# EAGLE design hackspace_sense (EAGLE 9.6.2)
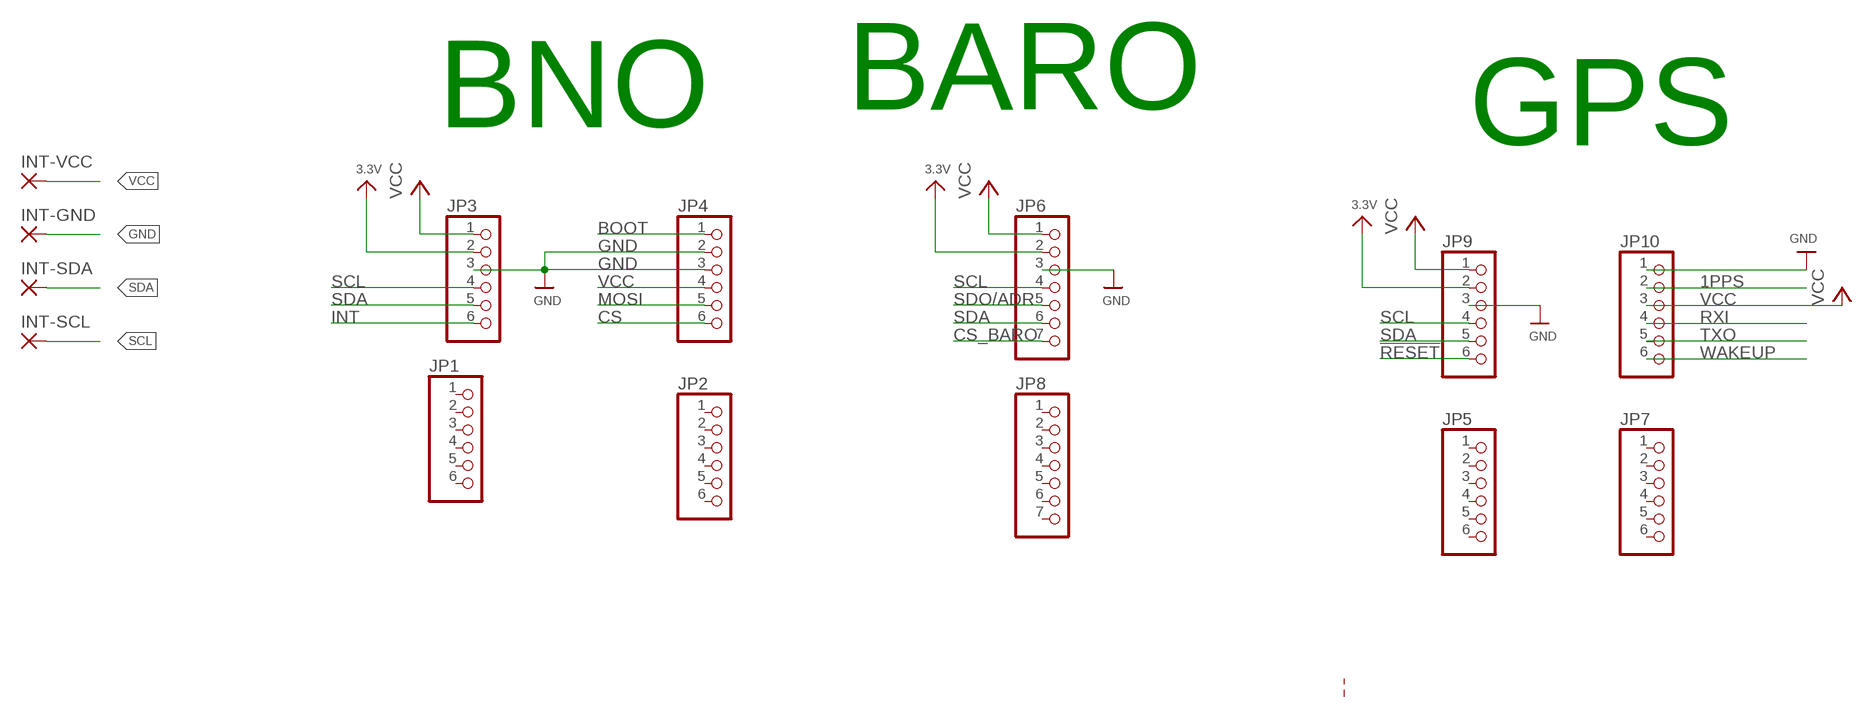
[diagram p0: schematic, sheet 1]

## Parts
INT-GND  3,17/1,1  [3,17/1,1]
INT-SCL  3,17/1,1  [3,17/1,1]
INT-SDA  3,17/1,1  [3,17/1,1]
INT-VCC  3,17/1,1  [3,17/1,1]
JP1  PINHD-1X6  [1X06]
JP2  PINHD-1X6  [1X06]
JP3  HEADER-1X670MIL  [1X06_ROUND_70]
JP4  HEADER-1X670MIL  [1X06_ROUND_70]
JP5  PINHD-1X6  [1X06]
JP6  HEADER-1X770MIL  [1X07_ROUND_70]
JP7  PINHD-1X6  [1X06]
JP8  PINHD-1X7  [1X07]
JP9  HEADER-1X670MIL  [1X06_ROUND_70]
JP10  HEADER-1X670MIL  [1X06_ROUND_70]

## Nets
1PPS: JP10.2
3.3V_BARO [lowpower]: JP6.2 ; supply symbol labelled 3.3V
3.3V_BNO [lowpower]: JP3.2 ; supply symbol labelled 3.3V
3.3V_GPS [lowpower]: JP9.2 ; supply symbol labelled 3.3V
!RESET: JP9.6
BOOT: JP4.1
CS: JP4.6
CS_BARO: JP6.7
GND: INT-GND.1(P) JP3.3 JP4.2 JP4.3 JP6.3 JP9.3 JP10.1
INT: JP3.6
MOSI: JP4.5
RXI: JP10.4
SCL: INT-SCL.1(P) JP3.4 JP6.4 JP9.4
SDA: INT-SDA.1(P) JP3.5 JP6.6 JP9.5
SDO/ADR: JP6.5
TXO: JP10.5
VCC: INT-VCC.1(P) JP3.1 JP4.4 JP6.1 JP9.1 JP10.3
WAKEUP: JP10.6
Unconnected: JP1.1 JP1.2 JP1.3 JP1.4 JP1.5 JP1.6 JP2.1 JP2.2 JP2.3 JP2.4 JP2.5 JP2.6 JP5.1 JP5.2 JP5.3 JP5.4 JP5.5 JP5.6 JP7.1 JP7.2 JP7.3 JP7.4 JP7.5 JP7.6 JP8.1 JP8.2 JP8.3 JP8.4 JP8.5 JP8.6 JP8.7

## Notes on the sheet
- BNO | BARO | GPS

## Library data of the parts
INT-GND INT-SCL INT-SDA INT-VCC = wirepad:3,17/1,1: THROUGH-HOLE PAD
JP1 JP2 JP5 JP7 = pinhead:PINHD-1X6: PIN HEADER
JP3 JP4 JP9 JP10 = microbuilder:HEADER-1X6: PIN HEADER
JP6 = microbuilder:HEADER-1X7: PIN HEADER
JP8 = pinhead:PINHD-1X7: PIN HEADER

## Net classes
1 highpower: width 0.406 mm, drill 0.483 mm
2 lowpower: width 0.305 mm, drill 0.483 mm

## Board
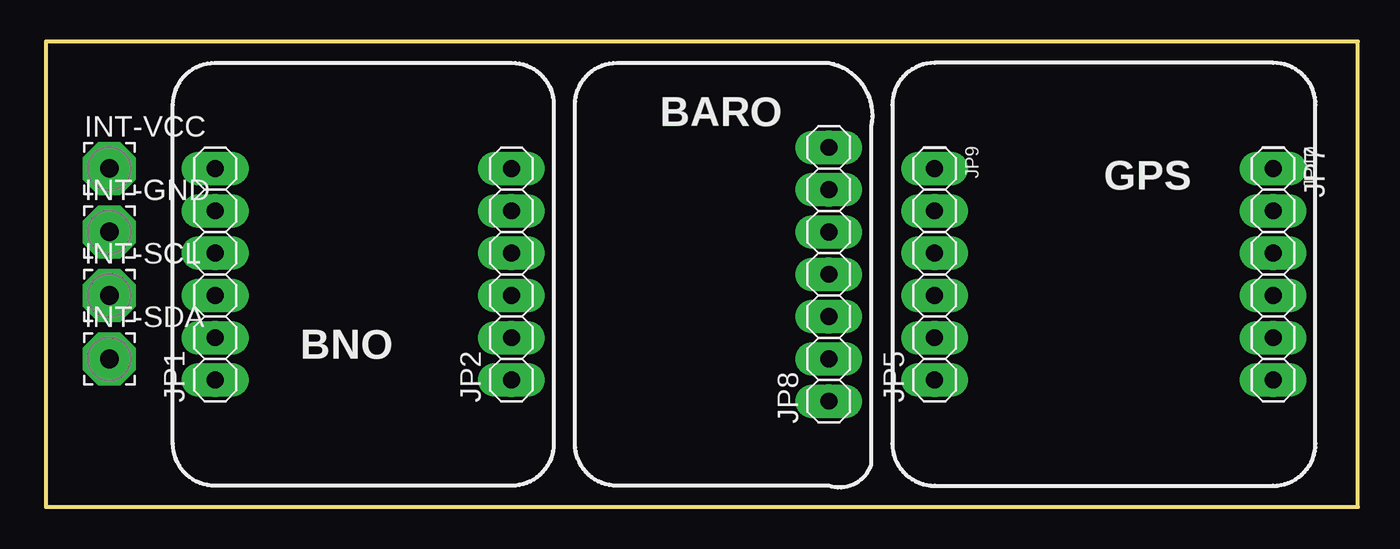
[diagram p1: board, top side]
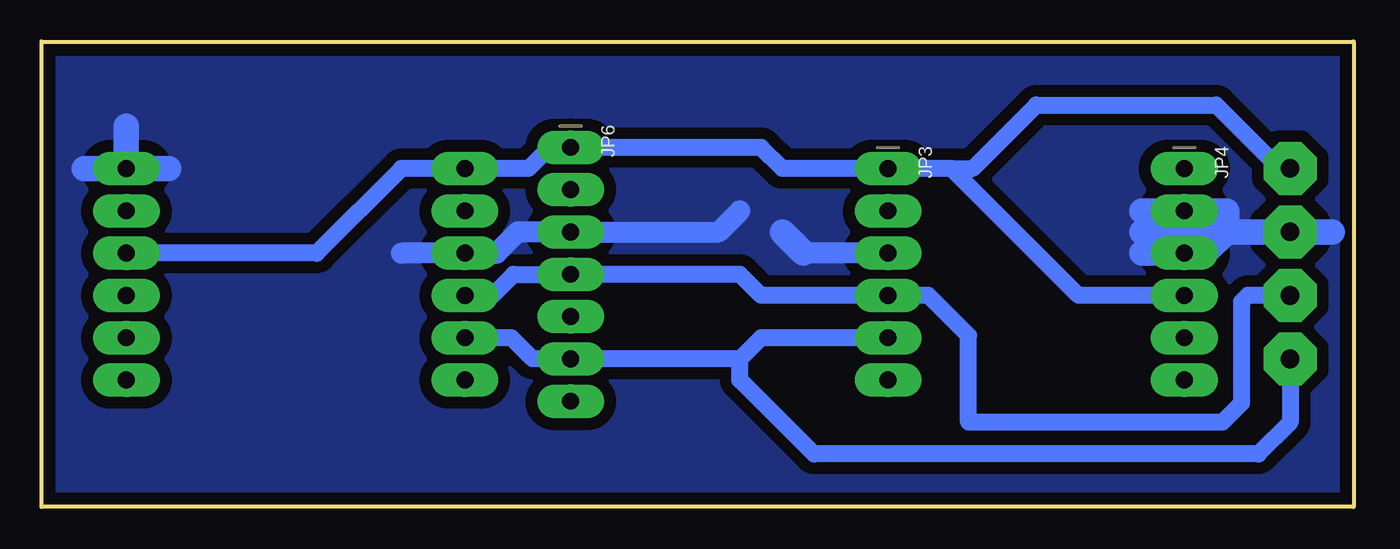
[diagram p2: board, bottom side, seen from below]

Size 78.74 x 27.94 mm. Coordinates in mm from the lower left corner, seen from the top.
Outline: 0,27.94 0,0 78.74,0 78.74,27.94 0,27.94
Copper layers (1*16): Top 0.035mm / dielectric 1.5mm / Bottom 0.035mm
Design rules "aisler_2_layer_simple *": minimum track width 0.1mm, minimum drill 0.3mm, track to track 0.1mm, track to pad 0.1mm, pad to pad 0.1mm, via to via 0.1mm, smd to smd 0.1mm, copper to edge 0.3mm, drill to drill 0.25mm, minimum pad ring 0.5mm, minimum via ring 0.2mm, stop-mask expansion 0mil, vias tented up to drill 0mil, thermal gap 32mil

### Footprints (pad centres in the part's own frame; a part is rotated, then mirrored left to right if it is on the bottom)
3,17/1,1 = drill 1.118 pad 3.175 octagon: 1 0,0
1X06 = drill 1.016 long: 1 -6.35,0; 2 -3.81,0; 3 -1.27,0; 4 1.27,0; 5 3.81,0; 6 6.35,0
1X06_ROUND_70 = drill 1 pad 1.778: 1 -6.35,0; 2 -3.81,0; 3 -1.27,0; 4 1.27,0; 5 3.81,0; 6 6.35,0
1X07_ROUND_70 = drill 1 pad 1.778: 1 -7.62,0; 2 -5.08,0; 3 -2.54,0; 4 0,0; 5 2.54,0; 6 5.08,0; 7 7.62,0
1X07 = drill 1.016 long: 1 -7.62,0; 2 -5.08,0; 3 -2.54,0; 4 0,0; 5 2.54,0; 6 5.08,0; 7 7.62,0

### Placement (x,y rotation side)
INT-GND  3.81,16.51 0 top
INT-SCL  3.81,12.7 0 top
INT-SDA  3.81,8.89 0 top
INT-VCC  3.81,20.32 0 top
JP1  10.16,13.97 90 top
JP2  27.94,13.97 90 top
JP3  27.94,13.97 270 bottom
JP4  10.16,13.97 270 bottom
JP5  53.34,13.97 90 top
JP6  46.99,13.97 270 bottom
JP7  73.66,13.97 270 top
JP8  46.99,13.97 90 top
JP9  53.34,13.97 270 top
JP10  73.66,13.97 270 top

### Tracks (layer width: path | path; a pad name or v marks a point on that pad's centre or on a via)
GND
  Bottom 1.27: JP3.3 33.02,15.24 | 57.15,15.24 JP9.3 51.44,15.24 50.17,16.51 JP6.3 38.1,16.51 36.83,17.78
  Bottom 1.524: JP4.3 JP4.2 | JP4.3 8.89,15.24 7.62,16.51 | 7.62,16.51 INT-GND.1 | JP4.2 7.62,17.78 7.62,16.51 | 33.02,15.24 34.29,16.51 | JP4.3 12.7,15.24 | JP4.2 12.7,17.78 | INT-GND.1 1.27,16.51 | JP10.1 71.12,20.32 | JP10.1 73.66,22.86 | JP10.1 76.2,20.32 | INT-GND.1 12.7,16.51
  pour Bottom (isolate 0.711): 0,27.94 0,0 78.74,0 78.74,27.94
SCL
  Bottom 1.016: INT-SCL.1 6.35,12.7 6.73,12.32 6.73,6.22 7.87,5.08 23.11,5.08 23.11,10.29 25.53,12.7 JP3.4 35.56,12.7 36.83,13.97 JP6.4 50.42,13.97 51.69,12.7 JP9.4
SDA
  Bottom 1.016: INT-SDA.1 3.81,5.08 5.71,3.17 32.39,3.17 36.83,7.62 36.83,8.89 | 36.83,8.89 35.56,10.16 JP3.5 | 36.83,8.89 JP6.6 49.28,8.89 50.55,10.16 JP9.5
VCC
  Bottom 1.016: JP4.4 16.51,12.7 24.13,20.32 | 24.13,20.32 JP3.1 34.29,20.32 35.56,21.59 JP6.1 48.26,21.59 49.53,20.32 JP9.1 57.15,20.32 62.23,15.24 JP10.3 | 24.13,20.32 22.86,20.32 19.05,24.13 8.25,24.13 4.44,20.32 INT-VCC.1

### Text on the board
tPlace: BARO | GPS | BNO